# Altium schematic sheet OMAPL-137-Manchester2.SchDoc: OMAPL 137 Manchester interface
size A4; SheetNumber: 2; SheetTotal: 2; PartNumber: PNxxx; Drawn By: Sebastian Kulik; ProjectName: OMAPL 137 Manchester interface
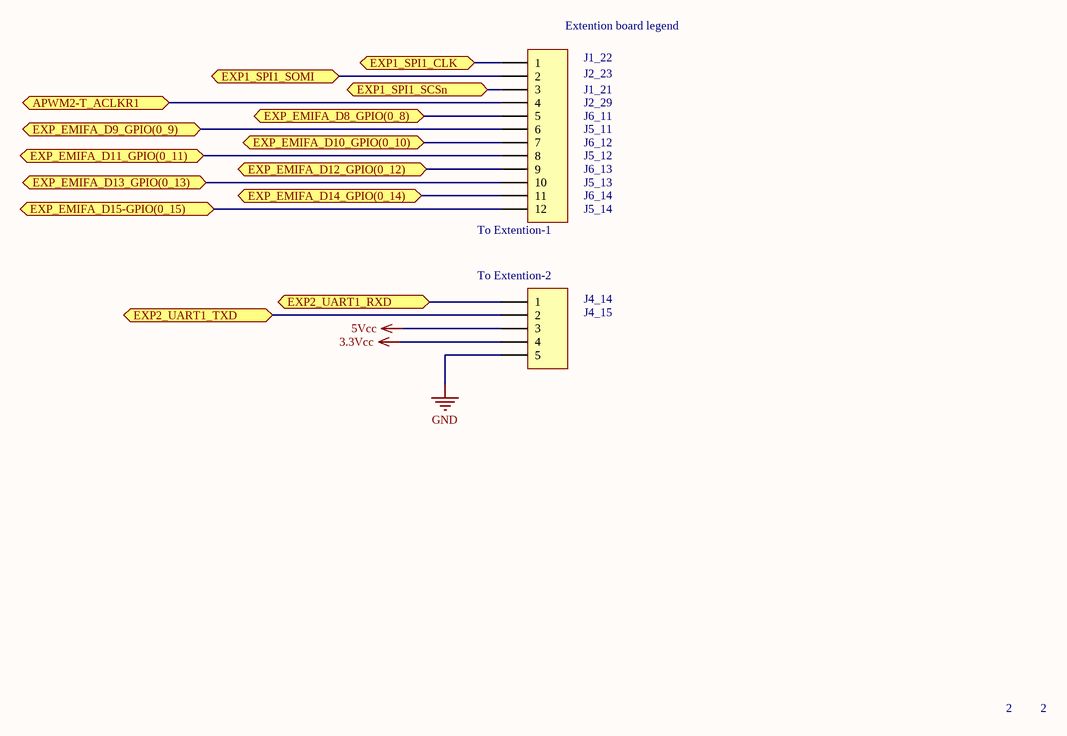
[diagram p0: OMAPL-137-Manchester2.SchDoc]

## Parts
To_Extention-1  Plug_12_2.54  [HDR1X12_2.54]  (value not drawn)
To_Extention-2  Plug_05_2.54  [HDR1X5_2.54]  (value not drawn)

## Ports
APWM2-T_ACLKR1, EXP1_SPI1_CLK, EXP1_SPI1_SCSn, EXP1_SPI1_SOMI, EXP2_UART1_RXD, EXP2_UART1_TXD, EXP_EMIFA_D8_GPIO(0_8), EXP_EMIFA_D9_GPIO(0_9), EXP_EMIFA_D10_GPIO(0_10), EXP_EMIFA_D11_GPIO(0_11), EXP_EMIFA_D12_GPIO(0_12), EXP_EMIFA_D13_GPIO(0_13), EXP_EMIFA_D14_GPIO(0_14), EXP_EMIFA_D15-GPIO(0_15)

## Nets
3.3Vcc: To_Extention-2.4
5Vcc: To_Extention-2.3
GND: To_Extention-2.5
APWM2-T_ACLKR1: To_Extention-1.4 ; port APWM2-T_ACLKR1
EXP1_SPI1_CLK: To_Extention-1.1 ; port EXP1_SPI1_CLK
EXP1_SPI1_SCSn: To_Extention-1.3 ; port EXP1_SPI1_SCSn
EXP1_SPI1_SOMI: To_Extention-1.2 ; port EXP1_SPI1_SOMI
EXP2_UART1_RXD: To_Extention-2.1 ; port EXP2_UART1_RXD
EXP2_UART1_TXD: To_Extention-2.2 ; port EXP2_UART1_TXD
EXP_EMIFA_D8_GPIO(0_8): To_Extention-1.5 ; port EXP_EMIFA_D8_GPIO(0_8)
EXP_EMIFA_D9_GPIO(0_9): To_Extention-1.6 ; port EXP_EMIFA_D9_GPIO(0_9)
EXP_EMIFA_D10_GPIO(0_10): To_Extention-1.7 ; port EXP_EMIFA_D10_GPIO(0_10)
EXP_EMIFA_D11_GPIO(0_11): To_Extention-1.8 ; port EXP_EMIFA_D11_GPIO(0_11)
EXP_EMIFA_D12_GPIO(0_12): To_Extention-1.9 ; port EXP_EMIFA_D12_GPIO(0_12)
EXP_EMIFA_D13_GPIO(0_13): To_Extention-1.10 ; port EXP_EMIFA_D13_GPIO(0_13)
EXP_EMIFA_D14_GPIO(0_14): To_Extention-1.11 ; port EXP_EMIFA_D14_GPIO(0_14)
EXP_EMIFA_D15-GPIO(0_15): To_Extention-1.12 ; port EXP_EMIFA_D15-GPIO(0_15)

## Notes on the sheet
- (near To_Extention-1) Extention board legend
- J1_22
- J2_23
- J1_21
- J2_29
- J6_11
- J5_11
- J6_12
- J5_12
- J6_13
- J5_13
- J6_14
- J5_14
- J4_14
- J4_15
- 2
- Title
- Date
- Part Number
- Revision
- Sheet
- of
- Drawn By
- File

## Library data of the parts
To_Extention-1 = Plug_12_2.54: Plug, 11-Pin; Manufacturer PartNr: 61301211121; Manufacturer: WE; TDE-PN: CON0018; LatestRevisionDate: 27.05.2014; LatestRevisionNote: Re-released for DXP Platform.; Publisher: Sebastian Kulik; Deliverer: WE; Deliverer PartNr: 61301211121
To_Extention-2 = Plug_05_2.54: Plug, 08-Pin; Manufacturer PartNr: 61300511121; Manufacturer: WE; TDE-PN: CON0036; LatestRevisionDate: 11.11.2014; LatestRevisionNote: Re-released for DXP Platform.; Publisher: Sebastian Kulik; Deliverer: WE; Deliverer PartNr: 61300511121